# EAGLE design EMS esp32 wifi lora gsm v2.7.2 (EAGLE 9.5.2)
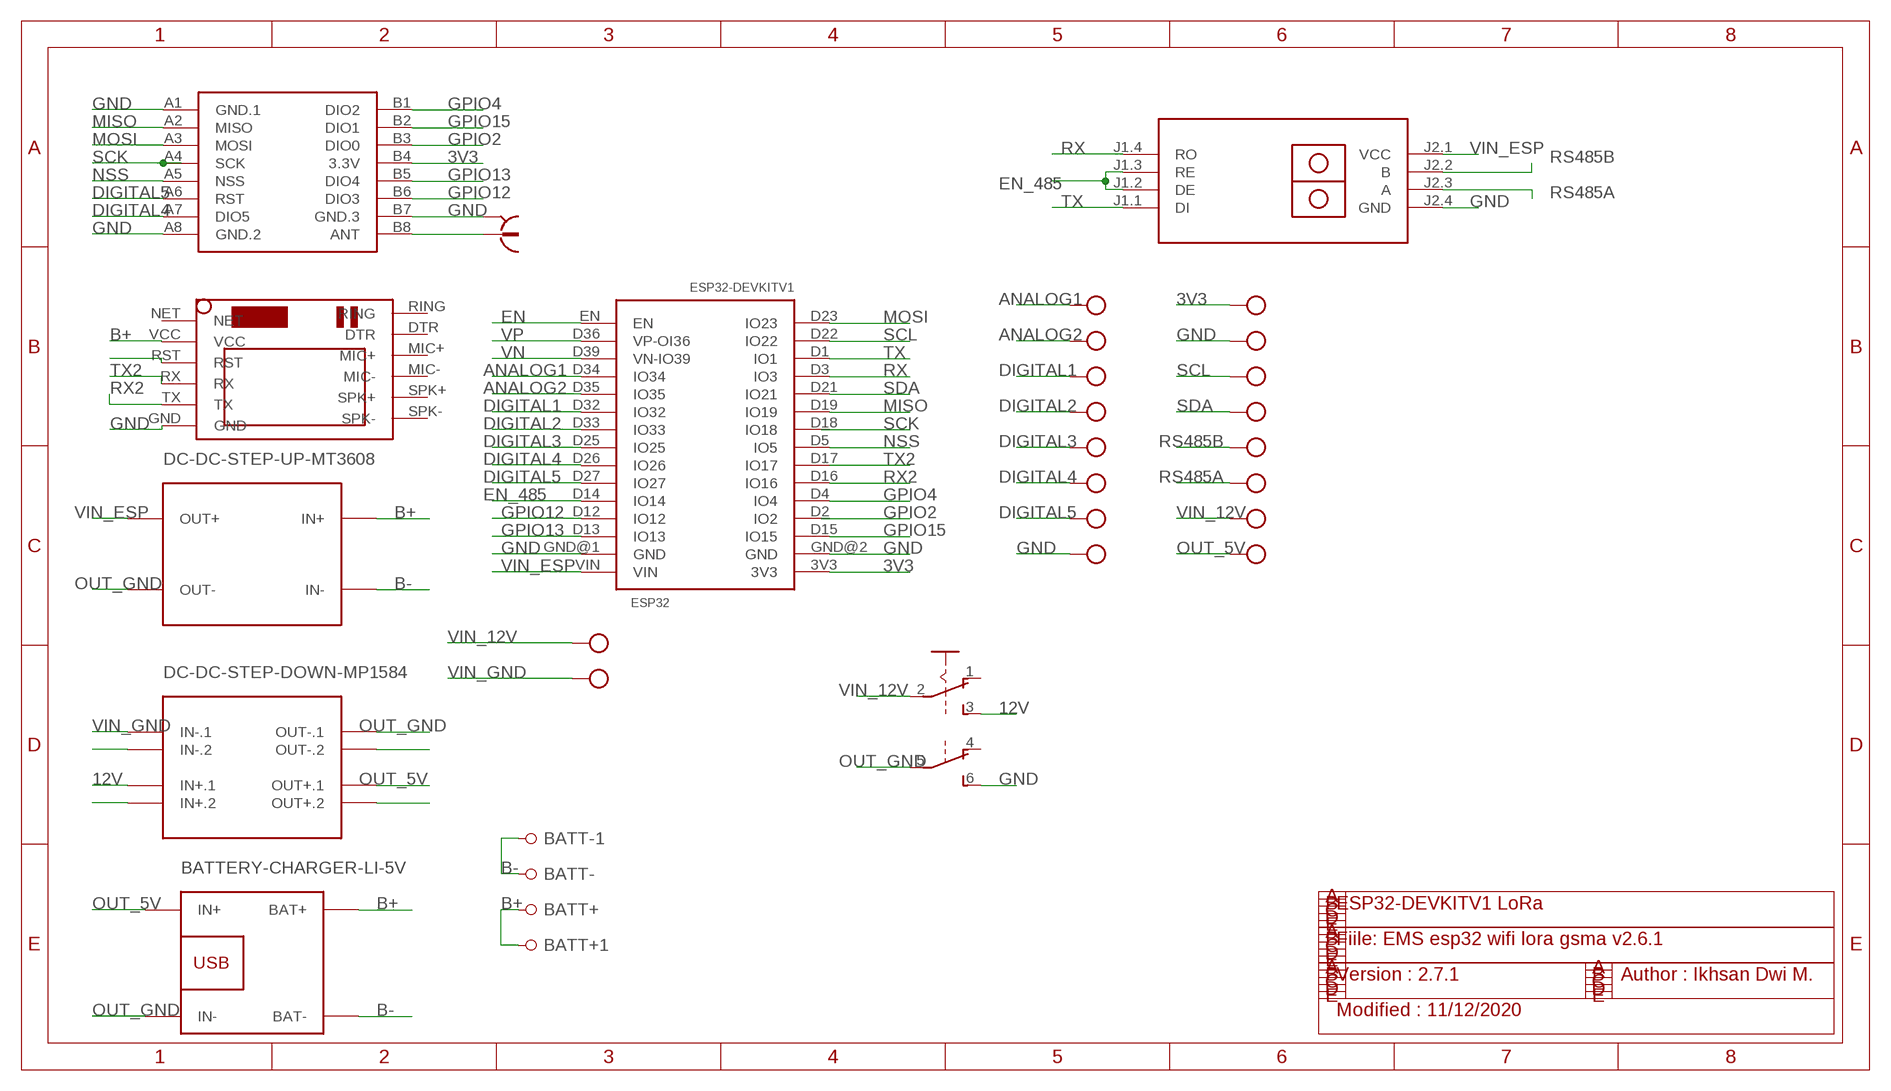
[diagram p0: schematic, sheet 1]

## Parts
3V3__GND  MKDSN1,5/2-5,08  [MKDSN1,5/2-5,08]
12V__5V  MKDSN1,5/2-5,08  [MKDSN1,5/2-5,08]
A1__A2  MKDSN1,5/2-5,08  [MKDSN1,5/2-5,08]
A_____B  MKDSN1,5/2-5,08  [MKDSN1,5/2-5,08]
BATT+  PIN-1X1_2.00  [1X01M]
BATT+1  PIN-1X1_2.00  [1X01M]
BATT-  PIN-1X1  [1X01NONAME]
BATT-1  PIN-1X1  [1X01NONAME]
D1__D2  MKDSN1,5/2-5,08  [MKDSN1,5/2-5,08]
D3__D4  MKDSN1,5/2-5,08  [MKDSN1,5/2-5,08]
D5_GND  MKDSN1,5/2-5,08  [MKDSN1,5/2-5,08]
ESP32  ESP32DEVKITV1  [ESP32-DEVKITV1]
S1  A68-A31  [A68-A31]
SCL__SDA  MKDSN1,5/2-5,08  [MKDSN1,5/2-5,08]
U$1  RS485-TTL-CONVERTER  [RS485-TTL-CONVERTER]
U$2  DC-DC-STEP-UP-MT3608  [DC-DC-STEP-UP-MT3608]
U$3  DC-DC-STEP-DOWN-MP1584  [DC-DC-STEP-DOWN-MP1584]
U$4  BATTERY-CHARGER-LI-5V  [BATTERY-CHARGER-LI-5V]
U$5  WIRELESS-LORA-RFM95W#SMD  [WIRELESS-LORA-RFM95W#SMD]
U$9  SIM800LMODULE  [SIM800LMODULE]
X1  734120110  [734120110]
X10  MKDSN1,5/2-5,08  [MKDSN1,5/2-5,08]

## Nets
3V3: 3V3__GND.1 ESP32.3V3 U$5.B4(3.3V)
12V [usbvcc]: S1.3(A:S) U$3.IN+.1
ANALOG1: A1__A2.1 ESP32.D34(IO34)
ANALOG2: A1__A2.2 ESP32.D35(IO35)
B+: BATT+1.1 BATT+.1 U$2.IN+ U$4.BAT+ U$9.VCC
B-: BATT-1.1 BATT-.1 U$2.IN- U$4.BAT-
DIGITAL1: D1__D2.1 ESP32.D32(IO32)
DIGITAL2: D1__D2.2 ESP32.D33(IO33)
DIGITAL3: D3__D4.1 ESP32.D25(IO25)
DIGITAL4: D3__D4.2 ESP32.D26(IO26) U$5.A7(DIO5)
DIGITAL5: D5_GND.1 ESP32.D27(IO27) U$5.A6(RST)
EN: ESP32.EN
EN_485: ESP32.D14(IO14) U$1.J1.2(DE) U$1.J1.3(RE)
GND: 3V3__GND.2 D5_GND.2 ESP32.GND@1(GND) ESP32.GND@2(GND) S1.6(B:S) U$1.J2.4(GND) U$5.A1(GND.1) U$5.A8(GND.2) U$5.B7(GND.3) U$9.GND X1.S@1 X1.S@2 X1.S@3
GPIO2: ESP32.D2(IO2) U$5.B3(DIO0)
GPIO4: ESP32.D4(IO4) U$5.B1(DIO2)
GPIO12: ESP32.D12(IO12) U$5.B6(DIO3)
GPIO13: ESP32.D13(IO13) U$5.B5(DIO4)
GPIO15: ESP32.D15(IO15) U$5.B2(DIO1)
MISO: ESP32.D19(IO19) U$5.A2(MISO)
MOSI: ESP32.D23(IO23) U$5.A3(MOSI)
N$2: U$9.RST
N$7: U$3.IN-.2
N$8: U$5.B8(ANT) X1.1
N$10: U$3.IN+.2
N$12: U$3.OUT-.2
N$14: U$3.OUT+.2
NSS: ESP32.D5(IO5) U$5.A5(NSS)
OUT_5V: 12V__5V.2 U$3.OUT+.1 U$4.IN+
OUT_GND: S1.5(B:P) U$2.OUT- U$3.OUT-.1 U$4.IN-
RS485A: A_____B.2 U$1.J2.3(A)
RS485B: A_____B.1 U$1.J2.2(B)
RX: ESP32.D3(IO3) U$1.J1.4(RO)
RX2: ESP32.D16(IO16) U$9.TX
SCK: ESP32.D18(IO18) U$5.A4(SCK)
SCL: ESP32.D22(IO22) SCL__SDA.1
SDA: ESP32.D21(IO21) SCL__SDA.2
TX: ESP32.D1(IO1) U$1.J1.1(DI)
TX2: ESP32.D17(IO17) U$9.RX
VIN_12V [usbvcc]: 12V__5V.1 S1.2(A:P) X10.1
VIN_ESP [usbvcc]: ESP32.VIN U$1.J2.1(VCC) U$2.OUT+
VIN_GND [usbvcc]: U$3.IN-.1 X10.2
VN: ESP32.D39(VN-IO39)
VP: ESP32.D36(VP-OI36)
Unconnected: S1.1(A:O) S1.4(B:O) U$9.DTR U$9.MIC+ U$9.MIC- U$9.NET U$9.RING U$9.SPK+ U$9.SPK-

## Notes on the sheet
- ESP32-DEVKITV1 LoRa
- Fiile: EMS esp32 wifi lora gsma v2.6.1
- Version : 2.7.1 | Author : Ikhsan Dwi M.
- Modified : 11/12/2020

## Library data of the parts
3V3__GND 12V__5V A1__A2 A_____B D1__D2 D3__D4 D5_GND SCL__SDA X10 = con-phoenix-508:MKDSN1,5/2-5,08: MKDSN 1,5/ 2-5,08 Printklemme Nennstrom: 13,5 A Nennspannung: 250 V Rastermaß: 5,08 mm Polzahl: 2 Anschlussart: Schraubanschluss Montage: Löten Anschlussrichtung Leiter/Platine: 0 ° Artikelnummer: 1729128 Source: http://eshop.phoenixcontact.com .. 1729128.pdf
BATT+ BATT+1 BATT- BATT-1 = pinhead-fixdrills:PIN-1X1: PIN HEADER
ESP32 = ESP32-DEVKITV1:ESP32DEVKITV1
S1 = switch:A68-A31: SLIDING SWITCH Siemens, distributor Buerklin, 11G766
U$1 = diy-modules:RS485-TTL-CONVERTER: RS485 to TTL converter based on MAX485 chip
U$2 = diy-modules:DC-DC-STEP-UP-MT3608: DC/DC Step-Up Regulator based on MT3608 chip MT3608 datasheet available here: https://www.olimex.com/Products/Breadboarding/BB-PWR-3608/resources/MT3608.pdf Click here to find device on ebay.com <http://www.ebay.com/sch/mt3608+module>
U$3 = diy-modules:DC-DC-STEP-DOWN-MP1584: DC/DC Step-Down Regulator based on MP1584 chip MP1584 datasheet available here: http://www.haoyuelectronics.com/Attachment/MP1584/MP1584.pdf Click here to find device on ebay.com <http://www.ebay.com/sch/mp1584+module>
U$4 = diy-modules:BATTERY-CHARGER-LI-5V: Lithium Battery 5V Charger More details available here: http://www.buildcircuit.com/how-to-use-micro-usb-5v-1a-lithium-battery-charging-board-charger-module/ Click here to find device on ebay.com <http://www.ebay.com/sch/tp4056+charger+usb>
U$5 = diy-modules:WIRELESS-LORA-RFM95W: 868/915 MHz LoRa Radio Transceiver Module based on SX1276 chip Click here to find device on ebay.com <http://www.ebay.com/sch/RFM95W+transceiver>
U$9 = SIM800LMODULE:SIM800LMODULE: SIM800L Module
X1 = con-coax:734120110: MICRO COAXIAL CONNECTOR RECEPTACLE VERTICAL Source: Data sheet <http://www.molex.com/pdm_docs/sd/734120110_sd.pdf>

## Net classes
1 power: width 0.61 mm, drill 0.508 mm, clearance 0.152 mm
2 gnd: width 0.305 mm, drill 0.508 mm, clearance 0.152 mm
3 usbvcc: width 0.508 mm, drill 0.508 mm, clearance 0.152 mm

## Board
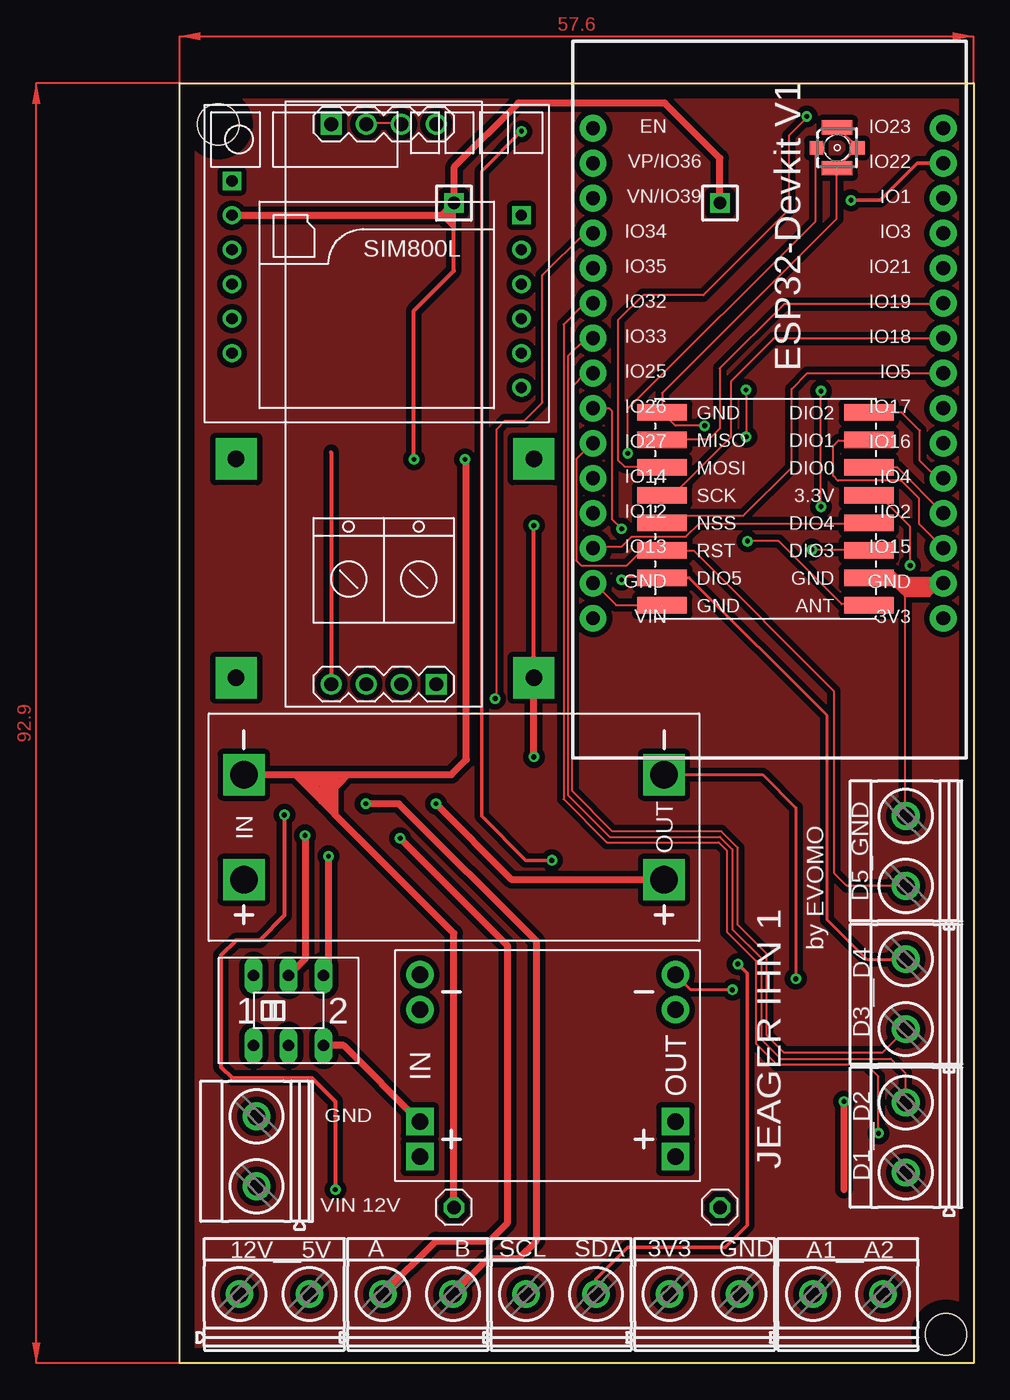
[diagram p1: board, top side]
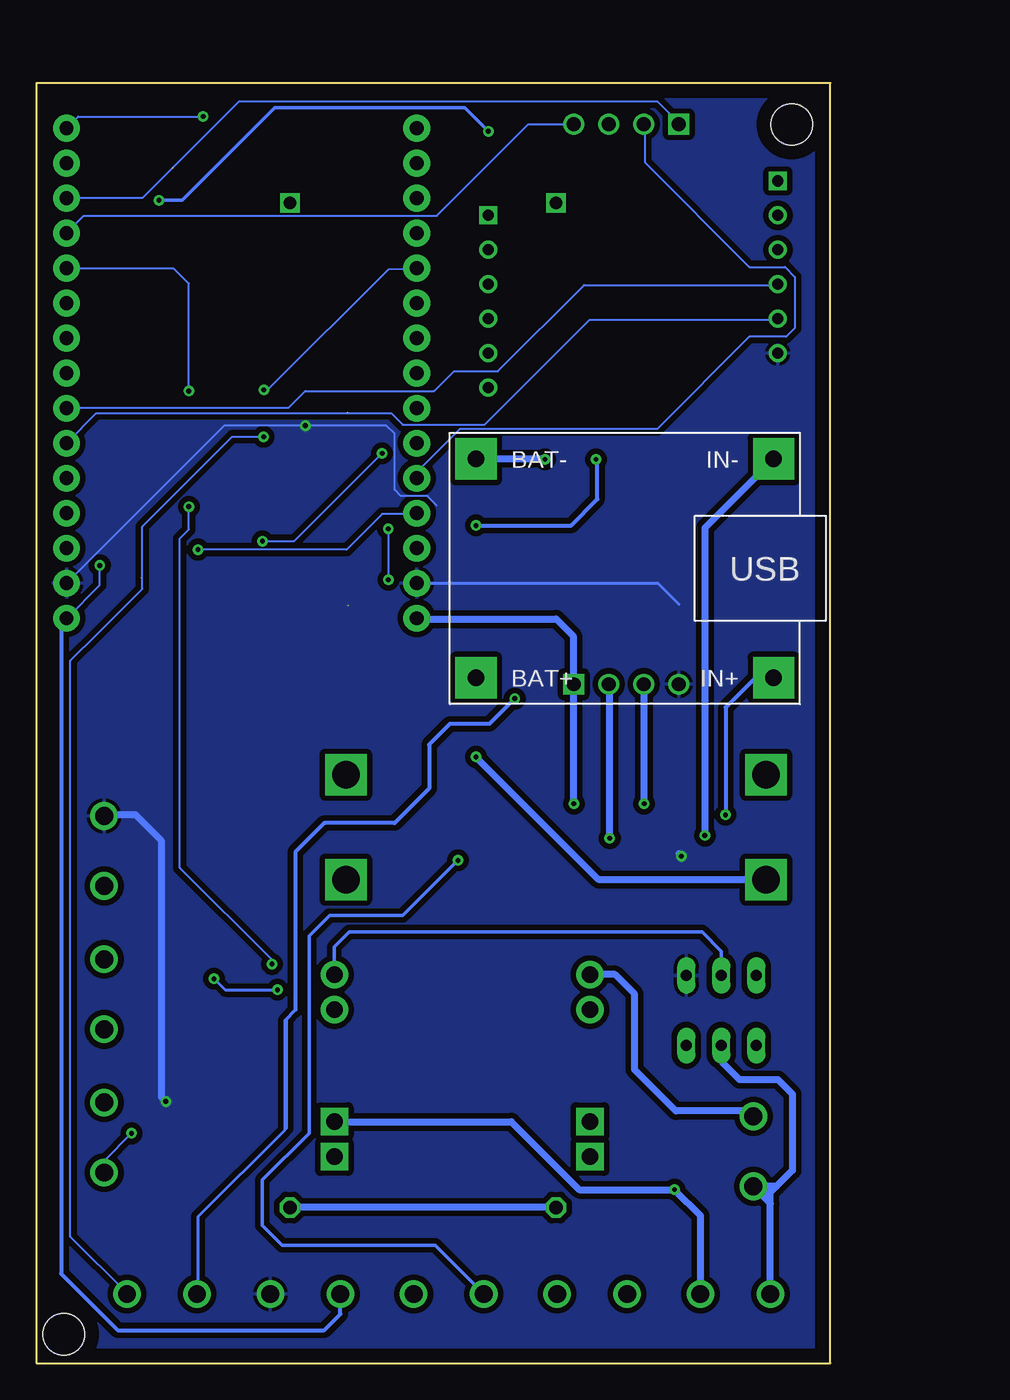
[diagram p2: board, bottom side, seen from below]

Size 57.6 x 92.9 mm. Coordinates in mm from the lower left corner, seen from the top.
Outline: 0,92.9 57.6,92.9 57.6,0 0,0 0,92.9
Copper layers (1*16): Top 0.035mm / dielectric 1.5mm / Bottom 0.035mm
Design rules "default": minimum track width 6mil, minimum drill 0.35mm, track to track 6mil, track to pad 6mil, pad to pad 6mil, via to via 6mil, smd to smd 6mil, copper to edge 40mil, drill to drill 6mil, minimum pad ring 10mil, minimum via ring 8mil, stop-mask expansion 4mil, vias tented up to drill 0mil, thermal gap 10mil
Holes 3 mm at 2.8,89.9 55.6,2.1

### Footprints (pad centres in the part's own frame; a part is rotated, then mirrored left to right if it is on the bottom)
MKDSN1,5/2-5,08 = drill 1.3 pad 2: 1 -2.561,0.025; 2 2.519,0.025
1X01M = drill 0.9 square: 1 0,0
1X01NONAME = drill 1 octagon: 1 0,0
ESP32-DEVKITV1 = drill 1 pad 1.93: 3V3 -16.52,-12.27; D1 13.96,-12.27; D2 -8.9,-12.27; D3 11.42,-12.27; D4 -6.36,-12.27; D5 1.26,-12.27; D12 -8.9,13.135; D13 -11.44,13.135; D14 -6.36,13.135; D15 -11.44,-12.27; D16 -3.82,-12.27; D17 -1.28,-12.27; D18 3.8,-12.27; D19 6.34,-12.27; D21 8.88,-12.27; D22 16.5,-12.27; D23 19.04,-12.27; D25 1.26,13.135; D26 -1.28,13.135; D27 -3.82,13.135; D32 6.34,13.135; D33 3.8,13.135; D34 11.42,13.135; D35 8.88,13.135; D36 16.5,13.135; D39 13.96,13.135; EN 19.04,13.135; GND@1 -13.98,13.135; GND@2 -13.98,-12.27; VIN -16.52,13.135
A68-A31 = drill 0.813 long: 1 -2.54,-2.54; 2 0,-2.54; 3 2.54,-2.54; 4 -2.54,2.54; 5 0,2.54; 6 2.54,2.54
RS485-TTL-CONVERTER = drill 1 square: J1.1 -20.32,-3.81; J2.1 20.32,3.81 | drill 1: J1.2 -20.32,-1.27; J1.3 -20.32,1.27; J1.4 -20.32,3.81; J2.2 20.32,1.27; J2.3 20.32,-1.27; J2.4 20.32,-3.81
DC-DC-STEP-UP-MT3608 = drill 2 pad 2.8 square: IN+ 15.24,3.81; IN- 15.24,-3.81; OUT+ -15.24,3.81; OUT- -15.24,-3.81
DC-DC-STEP-DOWN-MP1584 = drill 1.2 pad 2 square: IN+.1 -9.271,-4.064; IN+.2 -9.271,-6.604; OUT+.1 9.271,-4.064; OUT+.2 9.271,-6.604 | drill 1.2 pad 2: IN-.1 -9.271,6.604; IN-.2 -9.271,4.064; OUT-.1 9.271,6.604; OUT-.2 9.271,4.064
BATTERY-CHARGER-LI-5V = drill 1.2 pad 3 square: BAT+ 10.795,8.255; BAT- 10.795,-7.62; IN+ -10.795,8.255; IN- -10.795,-7.62
WIRELESS-LORA-RFM95W#SMD = smd 3.6 x 1.2: A1 -7.5,7; A2 -7.5,5; A3 -7.5,3; A4 -7.5,1; A5 -7.5,-1; A6 -7.5,-3; A7 -7.5,-5; A8 -7.5,-7; B1 7.5,7; B2 7.5,5; B3 7.5,3; B4 7.5,1; B5 7.5,-1; B6 7.5,-3; B7 7.5,-5; B8 7.5,-7
SIM800LMODULE = drill 0.8: DTR 10.5,1; GND -10.5,-6.5; MIC+ 10.5,-1.5; MIC- 10.5,-4; RST -10.5,1; RX -10.5,-1.5; SPK+ 10.5,-6.5; SPK- 10.5,-9; TX -10.5,-4; VCC -10.5,3.5 | drill 0.8 square: NET -10.5,6; RING 10.5,3.5
734120110 = smd 1 x 1: 1 0,-1.5; S@1 0,1.5 | smd 1.05 x 2.2: S@2 -1.475,0; S@3 1.475,0

### Placement (x,y rotation side)
3V3__GND  38.1,5 0 top
12V__5V  6.9,5 0 top
A1__A2  48.5,5 0 top
A_____B  17.3,5 0 top
BATT+  39.2,84.2 270 top
BATT+1  19.9,84.2 270 top
BATT-  39.2,11.3 270 top
BATT-1  19.9,11.3 270 top
D1__D2  52.7,16.4 90 top
D3__D4  52.7,26.8 90 top
D5_GND  52.7,37.2 90 top
ESP32  43.13,70.59 90 top
S1  7.9,25.6 0 top
SCL__SDA  27.7,5 0 top
U$1  14.8,69.6 270 top
U$2  19.9,38.9 180 top
U$3  26.7,21.6 0 top
U$4  14.9,58 180 bottom
U$5  42.5,62 0 top
U$9  14.3,79.8 0 top
X1  47.7,88.2 270 top
X10  5.6,15.4 90 top

### Tracks (layer width: path | path; a pad name or v marks a point on that pad's centre or on a via)
3V3  (via drill 0.35)
  Top 0.152: 55.37,54.14 ESP32.3V3 | v52.99,57.9 52.99,60.73 50.79,62.93 50.03,62.93 U$5.B4
  Bottom 0.152: v52.99,57.9 52.99,56.46 55.37,54.09 ESP32.3V3
  Bottom 0.305: ESP32.3V3 55.8,53.67 55.8,6.5 51.7,2.4 36.7,2.4 35.54,3.56 3V3__GND.1
12V
  Top 0.508: U$3.IN+.1 11.91,23.06 S1.3
ANALOG1  (via drill 0.35)
  Top 0.152: 29.92,82.03 ESP32.D34 29.38,82.01 26.32,78.95 26.32,69.72 25,68.4 23.6,68.4 22.99,67.79 22.99,48.34 v22.89,48.23
  Bottom 0.152: v22.89,48.23 22.89,48.08 | 38.8,25.64 39.45,25 39.45,17.06 39.55,16.95
  Bottom 0.2: A1__A2.1 45.85,5.11 45.85,10.65 39.55,16.95 39.55,24.8
  Bottom 0.254: 39.55,24.8 39.55,24.89 38.8,25.64
  Bottom 0.305: v22.89,48.23 24.73,46.4 27.6,46.4 29.1,44.9 29.1,41.7 31.6,39.2 36.7,39.2 38.8,37.1 38.8,25.64
ANALOG2  (via drill 0.35)
  Top 0.152: v41.09,70.64 41.09,67.24 v41.1,67.23
  Bottom 0.152: v41.09,70.64 40.79,70.64 32.04,79.39 ESP32.D35 | A1__A2.2 51.02,5.1 55.12,9.19 55.12,50.98 53.1,53 49.9,56.2 49.9,60.7 43.37,67.23 v41.1,67.23
B+  (via drill 0.35)
  Top 0.152: 19.88,84.14 19.89,84.16 BATT+1.1
  Top 0.305: U$4.BAT+ v25.7,60.8 | v17,65.6 17,76.4 19.89,79.29 19.89,82.41 | 19.89,84.16 19.89,82.41 | 19,83.3 19.2,83.1 | 19.55,83.45 19.9,83.8 BATT+1.1 19.9,82.9 19.65,82.65 | 19.55,83.45 19.2,83.1 | 19.2,83.1 19.55,82.75 | 19.89,82.41 19.65,82.65 | 19.55,82.75 19.65,82.65 | 19.55,82.75 19.55,83.45 | 19.65,82.65 19.65,83.35 19.55,83.45
  Top 0.508: v25.7,44 U$4.BAT+ | BATT+.1 39.2,87.45 35.2,91.45 24.55,91.45 19.89,86.79 19.89,84.16 | BATT+1.1 19,83.3 U$9.VCC
  Bottom 0.305: v25.7,60.8 18.8,60.8 16.9,62.7 16.9,65.5 v17,65.6
  Bottom 0.508: U$2.IN+ 16.79,35.09 v25.7,44
B-  (via drill 0.35)
  Top 0.254: 11.4,41.9 11.4,40.9 | 11.4,40.9 11.4,40.5 | 11.4,40.5 11.4,40.2 | 11.4,40.2 11.4,39.9 11.3,39.8 | 11.05,40.05 11.09,40.09 11.09,40.6 | 10.4,41.1 11.2,40.3 | 11.2,40.3 11.3,40.2 11.4,40.2 | 10.7,41.2 10.8,41.1 | 10.8,41.1 11.4,40.5 | 10.8,41.1 11.2,41.1 11.4,40.9 | 11.09,40.6 11.09,41.6 11.2,41.5 11.2,40.3 | 10.4,40.9 10.8,40.9 11.09,40.6
  Top 0.508: U$2.IN- 8.4,42.71 | 8.4,42.71 10.3,42.71 | 10.3,42.71 12.21,42.71 | 12.21,42.71 19.71,42.71 20.8,43.8 20.8,65.5 v20.7,65.6 | BATT-1.1 19.9,31.21 11.3,39.8 11.05,40.05 10.3,40.8 | 10.3,40.8 9.5,41.6 | 9.5,41.6 8.91,42.2 | 8.91,42.2 8.4,42.71 | 10.4,40.9 10.7,41.2 11.1,41.6 | 11.1,41.6 11.4,41.9 | 11.4,41.9 11.6,42.1 | 11.6,42.1 12.21,42.71 | 11.09,42.2 11.5,42.2 11.6,42.1 | 9.5,41.6 10.5,41.6 | 10.5,41.6 11.09,41.6 11.1,41.6 | 8.91,42.2 10.4,42.2 | 10.4,42.2 11.09,42.2 | 11.09,42.2 11.4,41.9 | 10.4,42.2 10.4,41.1 10.4,40.9 | 10.3,40.8 10.4,40.9 | 11.09,42.2 10.5,41.61 10.5,41.6 | 10.3,42.71 10.3,42.4 9.5,41.6
  Bottom 0.508: BATT-1.1 BATT-.1 | v20.7,65.6 25.67,65.6 U$4.BAT-
DIGITAL1  (via drill 0.35)
  Top 0.152: 29.92,77 ESP32.D32 29.41,76.93 27.86,75.38 27.86,40.94 31,37.8 39.1,37.8 39.7,37.2 39.7,31.3 41.8,29.2 41.8,23.2 43.3,21.7 49.8,21.7 50.69,20.81 v50.69,16.69
  Bottom 0.152: D1__D2.1 52.67,14.71 v50.69,16.69
DIGITAL2
  Top 0.152: 29.92,74.41 ESP32.D33 29.48,74.39 28.16,73.07 28.16,41.24 31.2,38.2 39.2,38.2 40.1,37.3 40.1,31.5 42.2,29.4 42.2,23.5 43.6,22.1 51.6,22.1 52.62,21.08 52.62,18.96 D1__D2.2
DIGITAL3
  Top 0.152: 29.92,71.89 ESP32.D25 29.43,71.85 28.47,70.89 28.47,41.53 31.4,38.6 39.3,38.6 40.5,37.4 40.5,31.8 42.6,29.7 42.6,23.8 43.86,22.54 50.97,22.54 D3__D4.1 52.62,24.3
DIGITAL4  (via drill 0.35)
  Top 0.152: 29.92,69.38 ESP32.D26 31.18,69.31 31.36,69.12 31.36,61.26 v32.06,60.56 | 36.7,56.99 35.02,56.99 U$5.A7 34.94,57.06 32.26,57.06 v32.06,56.86
  Top 0.2: D3__D4.2 49.83,29.32 46.96,32.19 46.96,47.01 36.98,56.99 36.7,56.99
  Bottom 0.152: v32.06,60.56 v32.06,56.86
DIGITAL5
  Top 0.152: 29.92,66.79 ESP32.D27 29.91,66.74 28.77,65.6 28.77,58.27 29.13,57.9 32.45,57.9 33.52,58.97 34.94,58.97 U$5.A6 35.02,58.97 37.28,58.97 47.47,48.78 47.47,35.57 48.4,34.64 D5_GND.1
EN
  Top 0.152: 29.92,89.65 ESP32.EN
EN_485
  Top 0.152: 29.92,64.27 ESP32.D14 | U$1.J1.2 13.53,89.98 16.05,89.98 U$1.J1.3
  Bottom 0.152: ESP32.D14 29.99,64.3 29.99,64.68 26.87,67.81 12.56,67.81 5.87,74.5 3.2,74.5 2.56,75.13 2.56,78.83 3.28,79.55 5.86,79.55 13.46,87.14 13.46,89.91 U$1.J1.2
GND  (via drill 0.35)  (4 unrouted)
  Top 0.152: 50.01,57.03 U$5.B7 | 49.19,88.23 47.75,89.68 X1.S@2 | 49.19,88.23 47.75,86.78 X1.S@3 | 49.19,88.23 X1.S@1 | 55.42,56.62 ESP32.GND@2 55.37,56.68 55.22,56.83 55.06,56.99 54.7,56.99 52.62,56.99 | 52.62,56.99 52.5,56.99 52.4,56.99 52.1,56.99 51.9,56.99 50.03,56.99 | 52.62,39.77 52.62,55.7 | 52.62,55.9 52.62,56 52.62,56.2 | 52.62,56.99 52.62,56.9 | 47.67,86.71 47.67,83.08 35,70.4 U$5.A1 | U$5.A1 35.02,69.03 | U$5.A1 35.96,68.04 v38.08,68.04 | 29.92,56.65 ESP32.GND@1 30.07,56.61 31.67,55.01 34.94,55.01
  Top 0.2: 51.32,57 52.06,56.26 | 52.06,56.26 52.16,56.16 | 52.16,56.16 52.36,55.96 | 52.36,55.96 52.62,55.7 | 51.62,57 51.81,56.81 | 51.81,56.81 52.51,56.11 | 52.51,56.11 52.62,56 52.63,56.01 54.69,56.01 | 52.62,55.7 52.62,55.9 | 52.62,55.9 52.62,56.2 | 52.62,56.2 52.62,56.4 | 52.62,56.4 52.62,56.5 | 52.62,56.5 52.62,56.7 | 52.62,56.7 52.62,56.9 52.7,56.83 55.22,56.83 | 52.51,56.11 52.51,56.98 | 52.5,56.99 52.51,56.98 | 52.62,55.9 52.51,56.01 52.51,56.11 | 52.36,55.96 52.36,56.9 | 52.36,56.9 52.36,56.95 52.4,56.99 | 52.16,56.16 52.16,56.7 52.27,56.81 | 52.36,56.9 52.28,56.82 | 52.06,56.26 52.06,56.95 52.1,56.99 | 52.1,57 52.26,57 52.36,56.9 | 52.1,57 52,57 51.7,57.3 51.7,57.5 52.22,56.98 52.51,56.98 | 52.1,57 52.28,56.82 | 52.28,56.82 52.27,56.81 | 52.27,56.81 51.81,56.81 | 51.9,56.99 54.7,56.99 | 52.62,55.7 54.38,55.7 54.54,55.86 | 54.54,55.86 54.69,56.01 | 54.69,56.01 54.79,56.11 | 54.79,56.11 54.99,56.31 | 54.99,56.31 55.18,56.5 | 55.18,56.5 55.24,56.56 | 55.24,56.56 55.37,56.68 | 52.62,55.9 54.5,55.9 54.54,55.86 | 52.62,56.2 54.7,56.2 54.79,56.11 | 52.62,56.4 54.9,56.4 54.99,56.31 | 52.62,56.5 55.18,56.5 | 52.62,56.7 55.1,56.7 55.24,56.56
  Top 0.305: 10.99,66.11 U$1.J2.4
  Top 0.508: 48.2,12.61 v48.2,19 | v10.8,36.8 10.8,28.5 S1.6
  Bottom 0.152: 55.42,56.54 ESP32.GND@2 55.37,56.68 55.32,56.68 43.96,68.04 v38.08,68.04 32.2,68.04 31.61,67.45 31.61,63.39 31.15,62.93 29.23,62.93 28.57,62.27 | 28.08,56.61 ESP32.GND@1
  Bottom 0.2: ESP32.GND@1 28.08,56.61 12.51,56.61 10.99,55.09 | ESP32.GND@1 28.79,56.61 | ESP32.GND@1 29.26,56.61
  Bottom 0.508: v48.2,19 48.5,19.3 48.5,37.9 50.4,39.8 52.59,39.8 D5_GND.2 | 10.99,36.99 v10.8,36.8
  pour Bottom (isolate 0.406): 0,92.9 57.6,92.9 57.6,0 0,0
GPIO2
  Top 0.152: U$5.B3 50.03,64.99 52.09,64.99 55.37,61.71 ESP32.D2
GPIO4
  Top 0.152: ESP32.D4 54.97,64.23 53.7,65.5 53.7,67.7 52.4,69 U$5.B1
GPIO12  (via drill 0.35)
  Top 0.152: 29.92,61.76 ESP32.D12 | v45.87,59.05 49.96,59.05 U$5.B6
  Bottom 0.152: v45.87,59.05 35.09,59.05 32.5,61.64 30.07,61.64 ESP32.D12
GPIO13
  Top 0.152: 29.92,59.17 ESP32.D13 30.07,59.2 30.14,59.27 32.09,59.27 32.8,59.98 36.72,59.98 37.69,60.95 49.96,60.95 U$5.B5
GPIO15
  Top 0.152: U$5.B2 49.96,66.97 47.79,66.97 47.4,66.58 47.4,64.4 47.76,64.05 52.34,64.05 53.65,62.74 53.65,60.92 55.37,59.2 ESP32.D15
MISO
  Top 0.152: U$5.A2 35.02,67.05 38.4,67.05 39.18,67.82 39.18,72.2 43.85,76.88 55.37,76.88 ESP32.D19
MOSI  (via drill 0.35)
  Top 0.152: 55.45,89.65 ESP32.D23 | U$5.A3 34.94,65.06 32.28,65.06 31.8,65.55 31.8,75.68 33.62,77.5 38,77.5 44.2,83.7 44.2,89.1 45.49,90.39 v45.49,90.47
  Bottom 0.152: ESP32.D23 54.56,90.47 v45.49,90.47
N$8  (via drill 0.35)
  Top 0.152: 50.01,55.05 U$5.B8 49.96,55.08 48.02,55.08 43.45,59.66 v41.19,59.66 | v32.51,66.04 32.51,69.26 46.15,82.9 46.15,88.15 X1.1
  Bottom 0.152: v41.19,59.66 38.89,59.66 v32.51,66.04
NSS
  Top 0.152: 36.09,61.03 35.02,61.03 U$5.A5 35.5,61.5 40.9,61.5 44.4,65 44.4,70.7 45.55,71.85 55.37,71.85 ESP32.D5
OUT_5V  (via drill 0.35)
  Top 0.305: v7.6,39.8 7.6,32.5 5.8,30.7 4.1,30.7 3,29.6 3,21.5 3.8,20.7 9.6,20.7 11.3,19 v11.3,12.6
  Bottom 0.305: U$4.IN+ 5.45,49.74 7.6,47.6 v7.6,39.8
  Bottom 0.508: U$3.OUT+.1 23.14,17.54 18.2,12.6 v11.3,12.6 9.42,10.72 12V__5V.2
OUT_GND  (via drill 0.35)
  Top 0.2: U$2.OUT- 42.29,42.71 44.7,40.3 v44.7,27.9 | v40.1,27.1 37.08,27.1 U$3.OUT-.1
  Top 0.508: v9.1,38.3 9.1,29.34 S1.5
  Bottom 0.2: 9.4,31.3 9.3,31.3 | v44.7,27.9 43.9,27.1 v40.1,27.1
  Bottom 0.254: U$3.OUT-.1 35.97,30.23 34.9,31.3 9.4,31.3 | 9.3,31.3 7.9,29.9 S1.5
  Bottom 0.508: U$4.IN- 9.1,60.62 v9.1,38.3
RS485A  (via drill 0.35)
  Top 0.508: A_____B.2 22.39,7.6 24.6,7.6 25.9,8.9 25.9,30.6 15.9,40.6 v13.5,40.6
  Bottom 0.508: v13.5,40.6 13.5,49.25 U$1.J2.3
RS485B  (via drill 0.35)
  Top 0.508: A_____B.1 18.61,8.9 22.5,8.9 23.8,10.2 23.8,30.3 v16,38.1
  Bottom 0.508: v16,38.1 16,49.21 U$1.J2.2
RX
  Top 0.152: 55.45,82.03 ESP32.D3
  Bottom 0.152: U$1.J1.4 18.64,89.91 21.91,89.91 28.53,83.28 54.15,83.28 55.37,82.06 ESP32.D3
RX2
  Bottom 0.152: 3.82,75.73 U$9.TX 3.86,75.73 17.46,75.73 25.08,68.11 31.02,68.11 31.85,68.95 53.23,68.95 55.37,66.82 ESP32.D16
SCK
  Top 0.152: U$5.A4 35.02,63.01 35.78,63.01 39.98,67.21 39.98,71.25 43.1,74.36 55.37,74.36 ESP32.D18
SCL  (via drill 0.35)
  Top 0.152: 55.45,87.13 ESP32.D22 55.3,87.09 | 25.19,5.1 SCL__SDA.1
  Top 0.254: v27,36.5 25.1,36.5 21.9,39.7 21.9,86.5 v24.8,89.4 | v48.7,84.4 50.81,84.4 53.5,87.09 55.3,87.09
  Bottom 0.152: 27.1,36.4 v27,36.5 | 36.35,32.45 36.3,32.5 | 28.66,8.54 28.71,8.6 39.8,8.6 41.2,10 | 37.8,30.9 37.8,31
  Bottom 0.254: SCL__SDA.1 28.66,8.54 39.74,8.54 41.2,10 41.2,13.3 37.8,16.7 37.8,30.9 | 37.8,31 36.35,32.45 | 36.3,32.5 31,32.5 27.1,36.4 | v24.8,89.4 26.5,91.1 40.3,91.1 47,84.4 v48.7,84.4
SDA  (via drill 0.35)
  Top 0.152: 55.45,79.51 ESP32.D21 | v46.53,62.16 v46.53,70.55 | 30.22,5.1 SCL__SDA.2
  Top 0.2: 30.2,6.1 30.2,5.12 30.22,5.1
  Top 0.254: v40.49,28.98 41.19,28.27 41.19,10 39.59,8.4 32.5,8.4 30.2,6.1
  Bottom 0.152: 55.42,79.4 ESP32.D21 47.65,79.47 46.53,78.35 v46.53,70.55 | v46.53,62.16 46.53,60.5 47.18,59.85 47.18,35.96 40.49,29.27 v40.49,28.98
TOP
  pour Top (isolate 0.406): 0,92.9 57.6,92.9 57.6,0 0,0
TX
  Top 0.152: 55.45,84.54 ESP32.D1
  Bottom 0.152: U$1.J1.1 10.99,90.01 12.55,91.57 42.88,91.57 49.88,84.57 55.37,84.57 ESP32.D1
TX2
  Bottom 0.152: 55.35,69.34 ESP32.D17 55.29,69.33 39.29,69.33 38.07,70.55 28.73,70.55 27.29,72 24.12,72 17.86,78.25 3.86,78.25 U$9.RX
VIN_12V
  Bottom 0.508: 5.07,12.33 X10.1 3.91,12.84 | 5.07,12.33 4.34,11.6 | 12V__5V.1 4.34,11.6 | S1.2 7.8,22.96 7.8,21.8 6.6,20.6 3.8,20.6 2.75,19.55 2.75,14 3.91,12.84 | 4.34,11.6 4.34,12.41 | 4.34,12.41 3.91,12.84 | 4.34,12.41 4.99,12.41 5.07,12.33
VIN_ESP  (via drill 0.35)
  Top 0.508: U$2.OUT+ 24.11,35.09 v18.6,40.6
  Bottom 0.508: ESP32.VIN 29.99,54.02 19.9,54.02 18.61,52.73 U$1.J2.1 v18.6,40.6
VIN_GND
  Bottom 0.508: X10.2 5.96,18.3 11.2,18.3 14.2,21.3 14.2,26.8 15.6,28.2 U$3.IN-.1
VN
  Top 0.152: 29.92,84.62 ESP32.D39
VP
  Top 0.152: 29.92,87.13 ESP32.D36
(copper drawn outside any net)
  shapes: Top area x2

### Text on the board
tPlace: by EVOMO | GND | JEAGER IHN 1 | VIN 12V